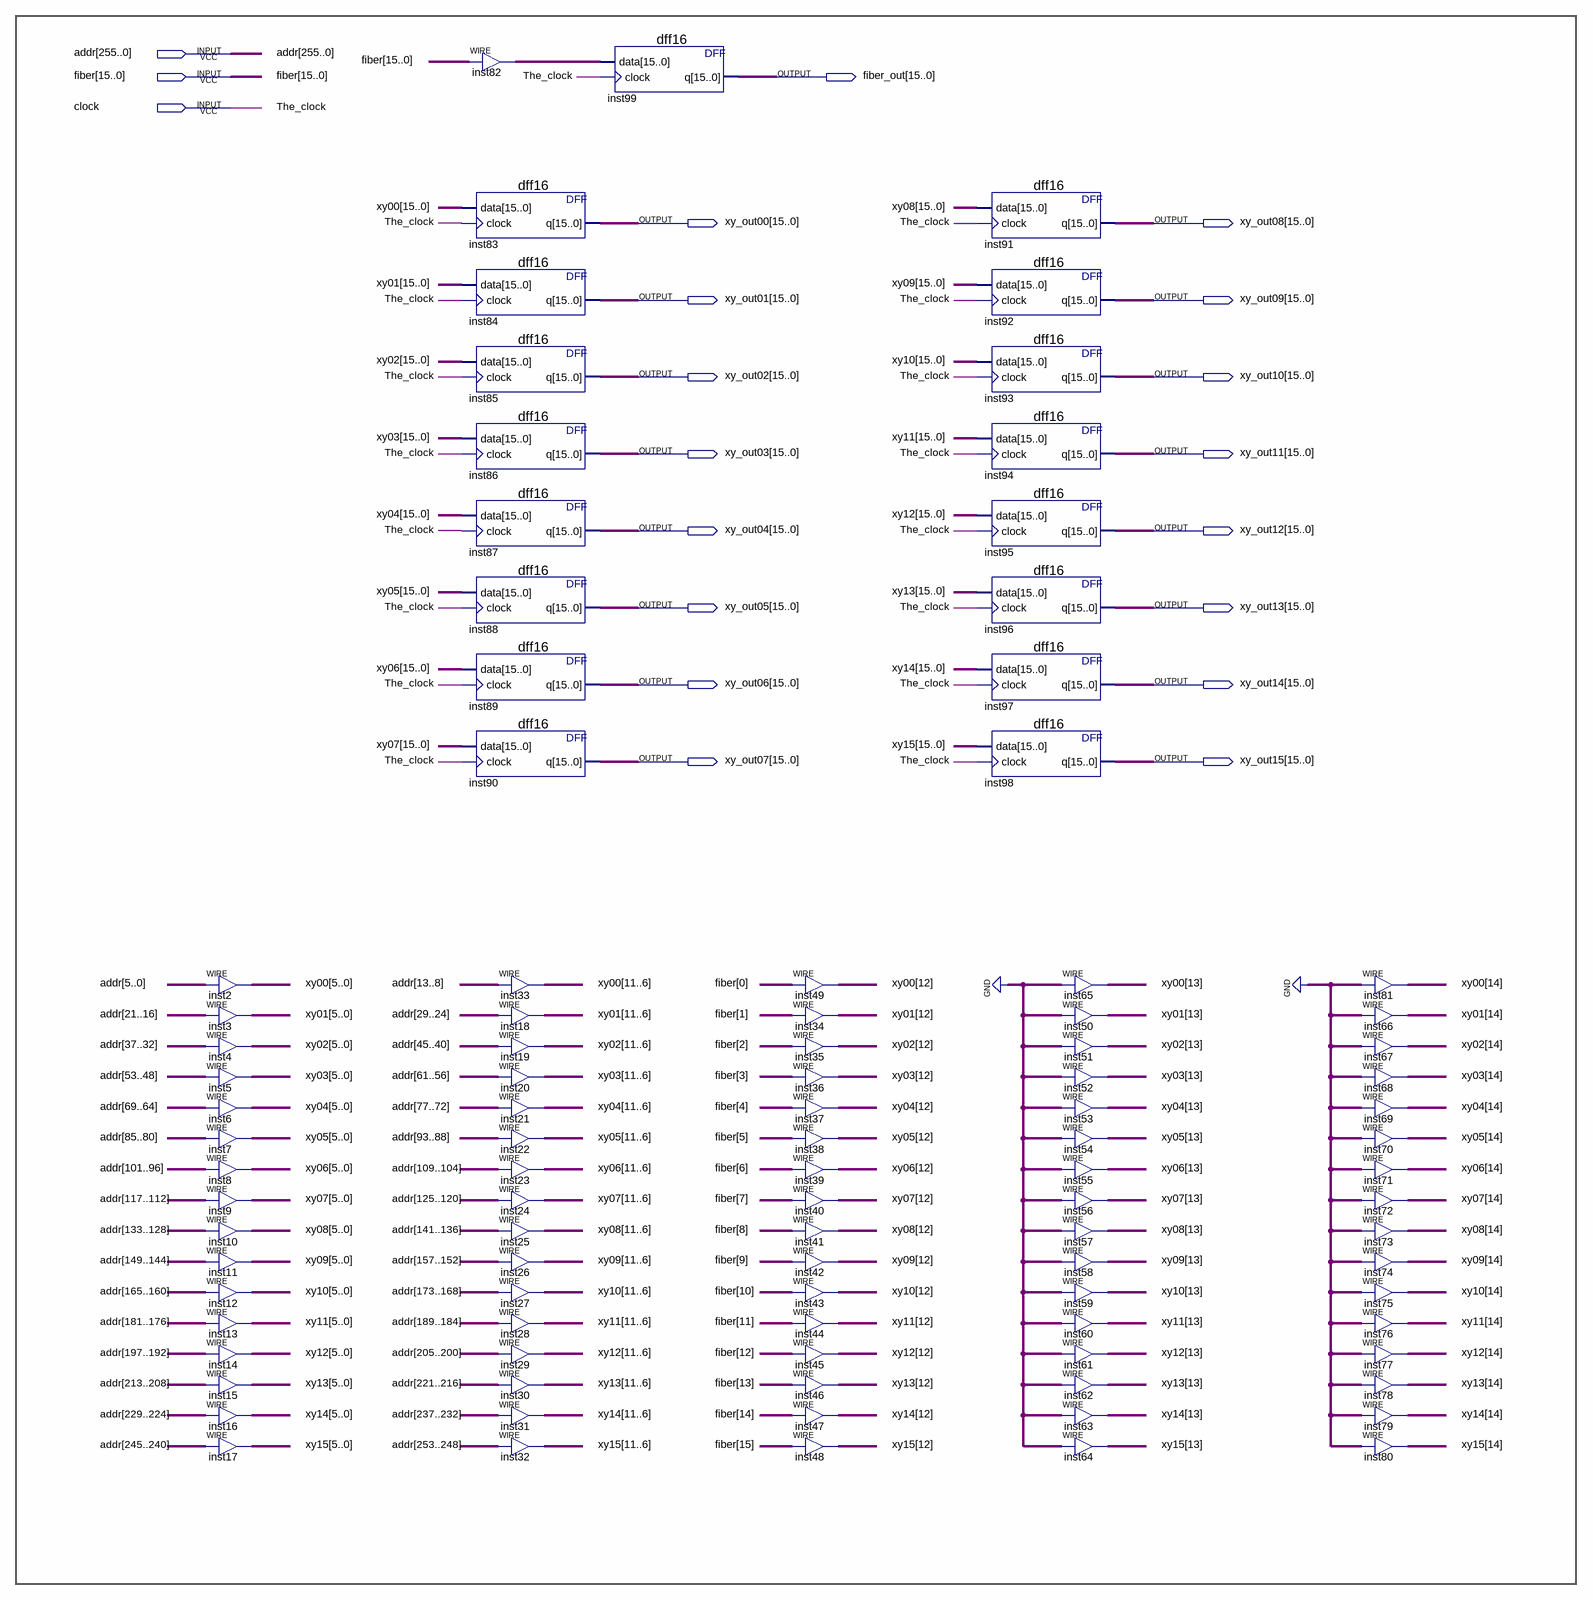
[diagram p0: schematic sheet]
// Quartus schematic csi_addr2.bdf as structural Verilog: 98 symbols, 20 pins
module csi_addr2 (
  input  [255:0] addr,
  input  [15:0] fiber,
  input  clock,
  output [15:0] fiber_out,
  output [15:0] xy_out00,
  output [15:0] xy_out08,
  output [15:0] xy_out01,
  output [15:0] xy_out09,
  output [15:0] xy_out02,
  output [15:0] xy_out10,
  output [15:0] xy_out03,
  output [15:0] xy_out11,
  output [15:0] xy_out04,
  output [15:0] xy_out12,
  output [15:0] xy_out05,
  output [15:0] xy_out13,
  output [15:0] xy_out06,
  output [15:0] xy_out14,
  output [15:0] xy_out07,
  output [15:0] xy_out15
);

  wire [15:0] inst82_out, xy00, xy01, xy02, xy03, xy04, xy05, xy06, xy07, xy08, xy09, xy10, xy11, xy12, xy13,
       xy14, xy15;

  assign xy00[5:0] = addr[5:0];  // WIRE inst2
  assign xy01[5:0] = addr[21:16];  // WIRE inst3
  assign xy02[5:0] = addr[37:32];  // WIRE inst4
  assign xy03[5:0] = addr[53:48];  // WIRE inst5
  assign xy04[5:0] = addr[69:64];  // WIRE inst6
  assign xy05[5:0] = addr[85:80];  // WIRE inst7
  assign xy06[5:0] = addr[101:96];  // WIRE inst8
  assign xy07[5:0] = addr[117:112];  // WIRE inst9
  assign xy08[5:0] = addr[133:128];  // WIRE inst10
  assign xy09[5:0] = addr[149:144];  // WIRE inst11
  assign xy10[5:0] = addr[165:160];  // WIRE inst12
  assign xy11[5:0] = addr[181:176];  // WIRE inst13
  assign xy12[5:0] = addr[197:192];  // WIRE inst14
  assign xy13[5:0] = addr[213:208];  // WIRE inst15
  assign xy14[5:0] = addr[229:224];  // WIRE inst16
  assign xy15[5:0] = addr[245:240];  // WIRE inst17
  assign inst82_out = fiber;  // WIRE inst82
  dff16 inst83 (.data(xy00), .clock(clock), .q(xy_out00));
  dff16 inst84 (.data(xy01), .clock(clock), .q(xy_out01));
  dff16 inst85 (.data(xy02), .clock(clock), .q(xy_out02));
  dff16 inst86 (.data(xy03), .clock(clock), .q(xy_out03));
  dff16 inst87 (.data(xy04), .clock(clock), .q(xy_out04));
  dff16 inst88 (.data(xy05), .clock(clock), .q(xy_out05));
  dff16 inst89 (.data(xy06), .clock(clock), .q(xy_out06));
  dff16 inst90 (.data(xy07), .clock(clock), .q(xy_out07));
  assign xy00[11:6] = addr[13:8];  // WIRE inst33
  assign xy01[11:6] = addr[29:24];  // WIRE inst18
  assign xy02[11:6] = addr[45:40];  // WIRE inst19
  assign xy03[11:6] = addr[61:56];  // WIRE inst20
  assign xy04[11:6] = addr[77:72];  // WIRE inst21
  assign xy05[11:6] = addr[93:88];  // WIRE inst22
  assign xy06[11:6] = addr[109:104];  // WIRE inst23
  assign xy07[11:6] = addr[125:120];  // WIRE inst24
  assign xy08[11:6] = addr[141:136];  // WIRE inst25
  assign xy09[11:6] = addr[157:152];  // WIRE inst26
  assign xy10[11:6] = addr[173:168];  // WIRE inst27
  assign xy11[11:6] = addr[189:184];  // WIRE inst28
  assign xy12[11:6] = addr[205:200];  // WIRE inst29
  assign xy13[11:6] = addr[221:216];  // WIRE inst30
  assign xy14[11:6] = addr[237:232];  // WIRE inst31
  assign xy15[11:6] = addr[253:248];  // WIRE inst32
  dff16 inst99 (.data(inst82_out), .clock(clock), .q(fiber_out));
  assign xy00[12] = fiber[0];  // WIRE inst49
  assign xy01[12] = fiber[1];  // WIRE inst34
  assign xy02[12] = fiber[2];  // WIRE inst35
  assign xy03[12] = fiber[3];  // WIRE inst36
  assign xy04[12] = fiber[4];  // WIRE inst37
  assign xy05[12] = fiber[5];  // WIRE inst38
  assign xy06[12] = fiber[6];  // WIRE inst39
  assign xy07[12] = fiber[7];  // WIRE inst40
  assign xy08[12] = fiber[8];  // WIRE inst41
  assign xy09[12] = fiber[9];  // WIRE inst42
  assign xy10[12] = fiber[10];  // WIRE inst43
  assign xy11[12] = fiber[11];  // WIRE inst44
  assign xy12[12] = fiber[12];  // WIRE inst45
  assign xy13[12] = fiber[13];  // WIRE inst46
  assign xy14[12] = fiber[14];  // WIRE inst47
  assign xy15[12] = fiber[15];  // WIRE inst48
  dff16 inst91 (.data(xy08), .clock(clock), .q(xy_out08));
  dff16 inst92 (.data(xy09), .clock(clock), .q(xy_out09));
  dff16 inst93 (.data(xy10), .clock(clock), .q(xy_out10));
  dff16 inst94 (.data(xy11), .clock(clock), .q(xy_out11));
  dff16 inst95 (.data(xy12), .clock(clock), .q(xy_out12));
  dff16 inst96 (.data(xy13), .clock(clock), .q(xy_out13));
  dff16 inst97 (.data(xy14), .clock(clock), .q(xy_out14));
  dff16 inst98 (.data(xy15), .clock(clock), .q(xy_out15));
  assign xy00[13] = 1'b0;  // WIRE inst65
  assign xy01[13] = 1'b0;  // WIRE inst50
  assign xy02[13] = 1'b0;  // WIRE inst51
  assign xy03[13] = 1'b0;  // WIRE inst52
  assign xy04[13] = 1'b0;  // WIRE inst53
  assign xy05[13] = 1'b0;  // WIRE inst54
  assign xy06[13] = 1'b0;  // WIRE inst55
  assign xy07[13] = 1'b0;  // WIRE inst56
  assign xy08[13] = 1'b0;  // WIRE inst57
  assign xy09[13] = 1'b0;  // WIRE inst58
  assign xy10[13] = 1'b0;  // WIRE inst59
  assign xy11[13] = 1'b0;  // WIRE inst60
  assign xy12[13] = 1'b0;  // WIRE inst61
  assign xy13[13] = 1'b0;  // WIRE inst62
  assign xy14[13] = 1'b0;  // WIRE inst63
  assign xy15[13] = 1'b0;  // WIRE inst64
  assign xy00[14] = 1'b0;  // WIRE inst81
  assign xy01[14] = 1'b0;  // WIRE inst66
  assign xy02[14] = 1'b0;  // WIRE inst67
  assign xy03[14] = 1'b0;  // WIRE inst68
  assign xy04[14] = 1'b0;  // WIRE inst69
  assign xy05[14] = 1'b0;  // WIRE inst70
  assign xy06[14] = 1'b0;  // WIRE inst71
  assign xy07[14] = 1'b0;  // WIRE inst72
  assign xy08[14] = 1'b0;  // WIRE inst73
  assign xy09[14] = 1'b0;  // WIRE inst74
  assign xy10[14] = 1'b0;  // WIRE inst75
  assign xy11[14] = 1'b0;  // WIRE inst76
  assign xy12[14] = 1'b0;  // WIRE inst77
  assign xy13[14] = 1'b0;  // WIRE inst78
  assign xy14[14] = 1'b0;  // WIRE inst79
  assign xy15[14] = 1'b0;  // WIRE inst80

  // Other names for the same wires on the sheet: The_clock = clock
endmodule
